# Altium schematic sheet DPPXHK_10CL010_SDRAM.SchDoc
size A4
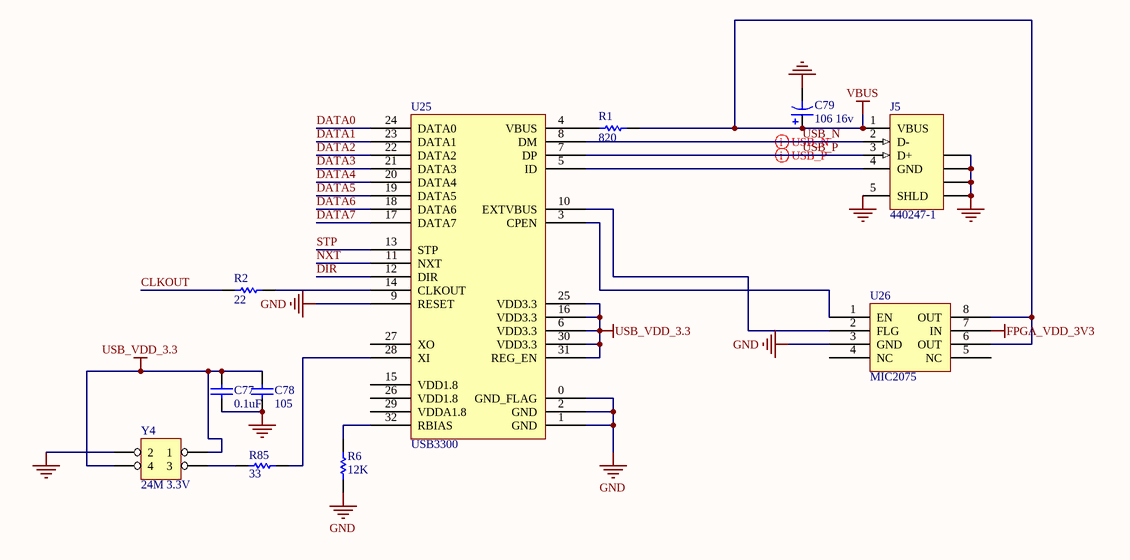
[diagram p0: DPPXHK_10CL010_SDRAM.SchDoc]

## Parts
C77  value 0.1uF  [LC0402]  (hidden comment: 104)
C78  105  [LC0402]
C79  106 16v  [LC0402]
J5  440247-1  [MCRO_USB]
R1  value 820  [0402R]  (hidden comment: 10K)
R2  value 22  [0402R]  (hidden comment: 10K)
R6  value 12K  [0402R]  (hidden comment: 10K)
R85  value 33  [0402R]  (hidden comment: 33R)
U25  USB3300  [QFN-32]
U26  MIC2075  [SOIC-8]
Y4  24M 3.3V  [OSCILLATOR-3.2X2.5]

## Nets
FPGA_VDD_3V3: U26.7(IN)
GND: C77.1 C78.1 C79.2 J5.5(SHLD) J5.6(SHLD) J5.7(SHLD) J5.8(SHLD) J5.9(SHLD) R6.1 U25.0(GND_FLAG) U25.1(GND) U25.2(GND) U25.9(RESET) U26.3(GND) Y4.2
USB_VDD_3.3: C77.2 C78.2 U25.6(VDD3.3) U25.16(VDD3.3) U25.25(VDD3.3) U25.30(VDD3.3) U25.31(REG_EN) Y4.1 Y4.4
VBUS: C79.1 J5.1(VBUS) R1.1 U26.6(OUT) U26.8(OUT)
CLKOUT: R2.2
DATA0: U25.24(DATA0)
DATA1: U25.23(DATA1)
DATA2: U25.22(DATA2)
DATA3: U25.21(DATA3)
DATA4: U25.20(DATA4)
DATA5: U25.19(DATA5)
DATA6: U25.18(DATA6)
DATA7: U25.17(DATA7)
DIR: U25.12(DIR)
NXT: U25.11(NXT)
STP: U25.13(STP)
USB_N: J5.2(D-) U25.8(DM)
USB_P: J5.3(D+) U25.7(DP)
NetJ5_4: J5.4(GND) U25.5(ID)
NetR1_2: R1.2 U25.4(VBUS)
NetR2_1: R2.1 U25.14(CLKOUT)
NetR6_2: R6.2 U25.32(RBIAS)
NetR85_1: R85.1 Y4.3
NetR85_2: R85.2 U25.28(XI)
NetU25_3: U25.3(CPEN) U26.1(EN)
NetU25_10: U25.10(EXTVBUS) U26.2(FLG)

Not connected (* = marked no-connect by the designer): U25 15(VDD1.8) 26(VDD1.8) 27(XO) 29(VDDA1.8); U26 4(NC) 5(NC)

## Layout directives
differential pair: USB_N, USB_P

## Library data of the parts
C77 C78 = Cap Semi: Capacitor (Semiconductor SIM Model); Published: 8-Jun-2000; Revision: July-2002: Re-released for DXP Platform.; Publisher: Altium Limited
  C78: Value: 105
C79 = Cap Pol3: Polarized Capacitor (Surface Mount); Published: 8-Jun-2000; LatestRevisionDate: 17-Jul-2002; LatestRevisionNote: Re-released for DXP Platform.; PackageReference: C0805; Publisher: Altium Limited
J5 = 440247-1: USB 2.0, Right Angle, SMT, B Type, Receptacle, 5 Position, Black; ContactMaterial: Copper Alloy; ContactPlating: Gold (30); PCB_Layout: Complies with manufacturer's recommendation.; DrillSize: Corresponds to nominal value.; PanelGround: Without; Published: 15-Jul-2004; DatasheetDocument: 27-Jun-2003; PackageDocument: 27-Jun-2003; PackageReference: 440247; Publisher: Altium Limited; ComponentLink1Description: Manufacturer Link; ComponentLink1URL: http://www.tycoelectronics.com/; HousingMaterial: Thermoplastic
R1 R2 R6 R85 = Res1: Resistor; Manufacturer: Generic Components; Class: Passive; Published: 08/06/2000; Publisher: Altium Hobart Technology Centre; SubClass: Resistor
Y4 = HEADER 2X2